# Altium schematic sheet QUTMS-TSAL-V00-S00.SchDoc: Tractive System Active Light - TSAL
size A3; DrawnBy: Joseph Richards; DocumentNumber: 1; Revision: 1; SheetNumber: 1; SheetTotal: 5
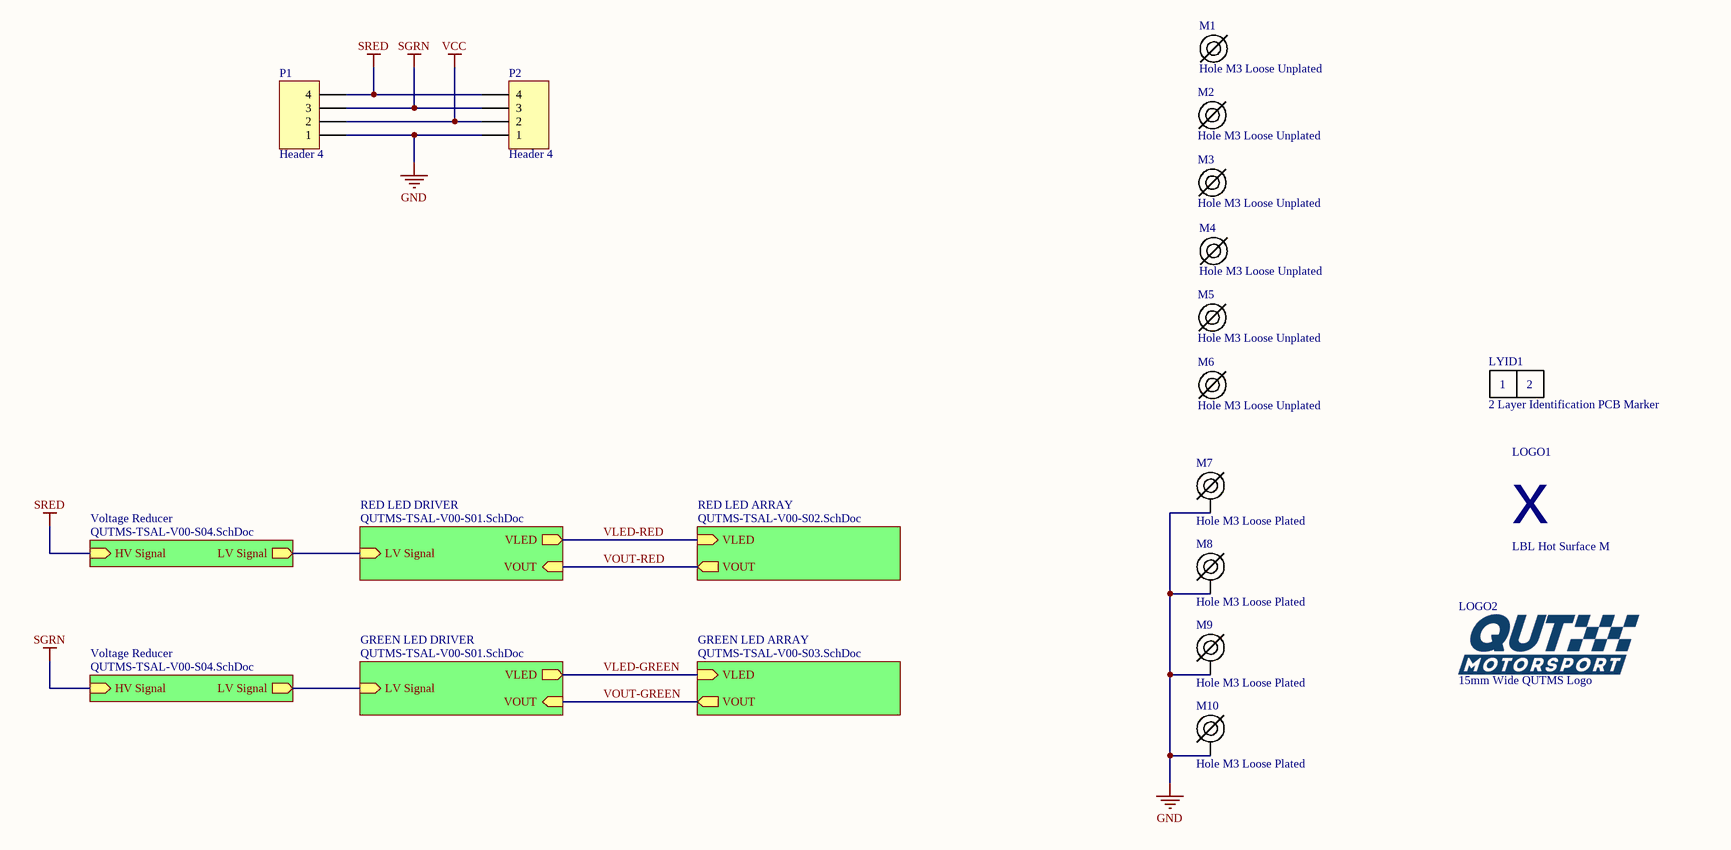
[diagram p0: QUTMS-TSAL-V00-S00.SchDoc]

## Parts
LOGO1  LBL Hot Surface M  [LBL HOT MEDIUM]
LOGO2  15mm Wide QUTMS Logo  [QUTMS LOGO 15MM]
LYID1  2 Layer Identification PCB Marker  [LAYER IDENT 2]
M1  Hole M3 Loose Unplated  [M3.5 UNPLATED]
M2  Hole M3 Loose Unplated  [M3.5 UNPLATED]
M3  Hole M3 Loose Unplated  [M3.5 UNPLATED]
M4  Hole M3 Loose Unplated  [M3.5 UNPLATED]
M5  Hole M3 Loose Unplated  [M3.5 UNPLATED]
M6  Hole M3 Loose Unplated  [M3.5 UNPLATED]
M7  Hole M3 Loose Plated  [M3.5 PLATED]
M8  Hole M3 Loose Plated  [M3.5 PLATED]
M9  Hole M3 Loose Plated  [M3.5 PLATED]
M10  Hole M3 Loose Plated  [M3.5 PLATED]
P1  Header 4  [HDR1X4]
P2  Header 4  [HDR1X4]

## Sub-sheets
GREEN LED ARRAY = QUTMS-TSAL-V00-S03.SchDoc: VOUT (out), VLED (in)
GREEN LED DRIVER = QUTMS-TSAL-V00-S01.SchDoc: VLED (out), VOUT (in), LV Signal (in)
RED LED ARRAY = QUTMS-TSAL-V00-S02.SchDoc: VOUT (out), VLED (in)
RED LED DRIVER = QUTMS-TSAL-V00-S01.SchDoc: VLED (out), VOUT (in), LV Signal (in)
Voltage Reducer = QUTMS-TSAL-V00-S04.SchDoc: HV Signal (in), LV Signal (out)
Voltage Reducer = QUTMS-TSAL-V00-S04.SchDoc: HV Signal (in), LV Signal (out)

## Nets
GND: M7.1 M8.1 M9.1 M10.1 P1.1 P2.1
SGRN: P1.3 P2.3 ; sheet Voltage Reducer/HV Signal
SRED: P1.4 P2.4 ; sheet Voltage Reducer/HV Signal
VCC: P1.2 P2.2
VLED-GREEN: sheet GREEN LED ARRAY/VLED, sheet GREEN LED DRIVER/VLED
VLED-RED: sheet RED LED DRIVER/VLED, sheet RED LED ARRAY/VLED
VOUT-GREEN: sheet GREEN LED ARRAY/VOUT, sheet GREEN LED DRIVER/VOUT
VOUT-RED: sheet RED LED DRIVER/VOUT, sheet RED LED ARRAY/VOUT
(unnamed): sheet RED LED DRIVER/LV Signal, sheet Voltage Reducer/LV Signal
(unnamed): sheet GREEN LED DRIVER/LV Signal, sheet Voltage Reducer/LV Signal

## Notes on the sheet
- Revision History:
- Sheet Title:
- Rev
- Date
- Description
- Project:
- Size:
- Drawn By:
- A3
- Number:
- Revision:
- Sheet
- Version:
- of
- QUT Motorsport
- O-120, Gardens Point
- 2 George Street
- Brisbane, QLD 4000
- Australia
- Print Date:
- Print Time:
- File Name:
- (in symbol Layer Identification 2) 1; 2
- (in symbol LBL Hot Surface M) x

## Library data of the parts
LOGO2 = QUTMS Logo 15mm
LYID1 = Layer Identification 2
M1-M6 = Hole M3 Loose Unplated: M3.5 Hole, No Plating
M7-M10 = Hole M3 Loose Plated: M3.5 Hole, Plated
P1 P2 = Header 4: Header, 4-Pin; LatestRevisionDate: 17-Jul-2002; LatestRevisionNote: Re-released for DXP Platform.; Publisher: Altium Limited